# EAGLE schematic SchematSUPLAXbee (EAGLE 7.7.0)
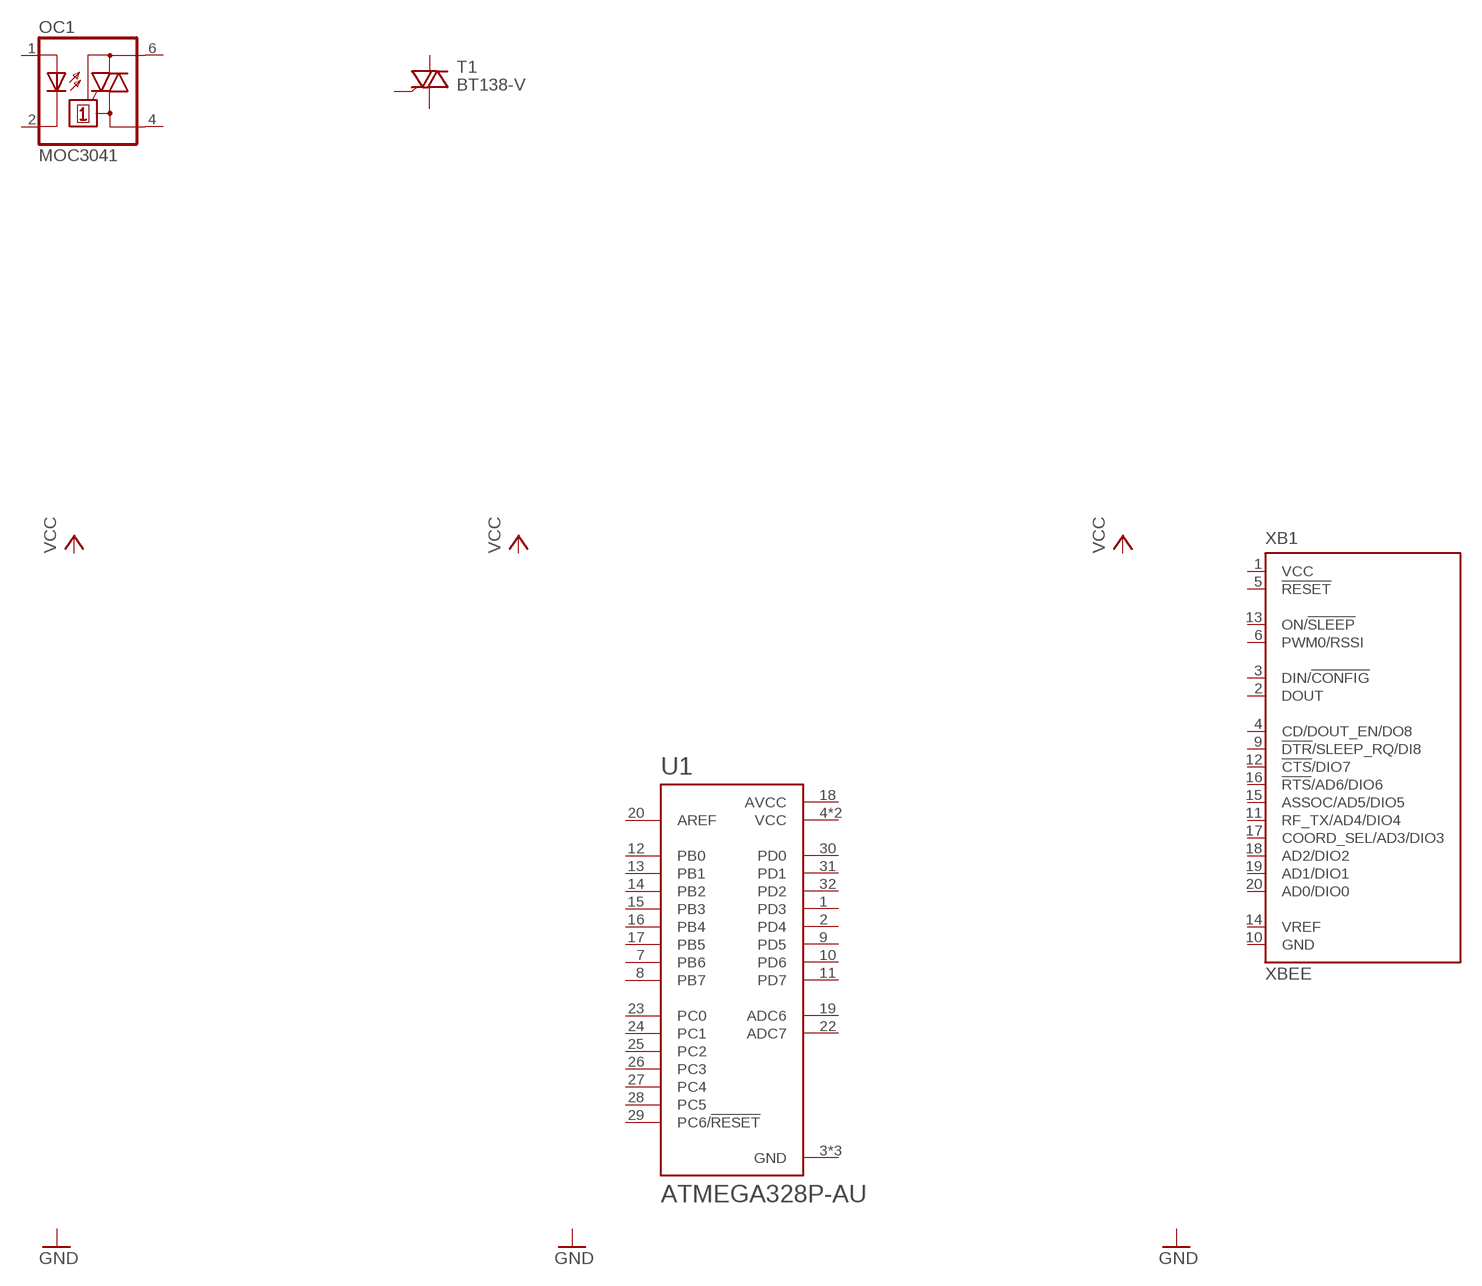
[diagram p0: schematic, sheet 1]

## Parts
OC1  MOC3041  [DIL06]
T1  BT138-V  [TO220BV]
U1  ATMEGA328P-AU  [QFP80P900X900X120-32N]
XB1  XBEE  [XBEE]
Unconnected: OC1.1(A) OC1.2(C) OC1.4(A1) OC1.6(A2) T1.G T1.T1(A1) T1.T2(A2) U1.1(PD3) U1.2(PD4) U1.7(PB6) U1.8(PB7) U1.9(PD5) U1.10(PD6) U1.11(PD7) U1.12(PB0) U1.13(PB1) U1.14(PB2) U1.15(PB3) U1.16(PB4) U1.17(PB5) U1.19(ADC6) U1.20(AREF) U1.22(ADC7) U1.23(PC0) U1.24(PC1) U1.25(PC2) U1.26(PC3) U1.27(PC4) U1.28(PC5) U1.29(PC6/!RESET) U1.30(PD0) U1.31(PD1) U1.32(PD2) XB1.2(DOUT) XB1.3(DIN/!CONFIG) XB1.4(CD/DOUT_EN/DO8) XB1.5(!RESET) XB1.6(PWM0/RSSI) XB1.9(!DTR!/SLEEP_RQ/DI8) XB1.11(RF_TX/AD4/DIO4) XB1.12(!CTS!/DIO7) XB1.13(ON/!SLEEP) XB1.14(VREF) XB1.15(ASSOC/AD5/DIO5) XB1.16(!RTS!/AD6/DIO6) XB1.17(COORD_SEL/AD3/DIO3) XB1.18(AD2/DIO2) XB1.19(AD1/DIO1) XB1.20(AD0/DIO0)

## Power pins joined to a net without a drawn wire
AVCC: U1.18(AVCC)
GND: U1.3(GND) U1.5(GND) U1.21(GND) XB1.10(GND)
VCC: U1.4(VCC) U1.6(VCC) XB1.1(VCC)

## Library data of the parts
OC1 = my_mixed:MOC3041
T1 = BT138:BT138: TRIAC Source: http://www.semiconductors.philips.com BT138_SERIES_2.pdf; AVAILABILITY: Unavailable; MF: NXP Semiconductors; MP: BT138; PACKAGE: None; PRICE: None
U1 = ATMEGA328P-AU:ATMEGA328P-AU: ATmega Series 20 MHz 32 KB Flash 2 KB SRAM 8-Bit Microcontroller - TQFP-32; AVAILABILITY: Good; DESCRIPTION: ATmega Series 20 MHz 32 KB Flash 2 KB SRAM 8-Bit Microcontroller - TQFP-32; MF: Atmel; MP: ATMEGA328P-AU; PACKAGE: TQFP-32 Atmel; PRICE: 2.09 USD
XB1 = maxstream:XBEE: XBee (TM) /XBee-PRO(TM) OEM RF Modules Source: MaxStream, Inc. xbee_productmanual.pdf; MPN: XBP24-Z7UIT-004; OC_FARNELL: 1751799; OC_NEWARK: 34R5507